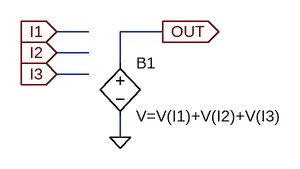
[diagram p0: schematic Sum3p.asc]
Sum3p.asc, the LTspice schematic file:
Version 4
SHEET 1 1188 680
WIRE 304 224 256 224
WIRE 416 224 352 224
WIRE 304 256 256 256
WIRE 352 272 352 224
WIRE 304 288 256 288
WIRE 352 384 352 352
FLAG 256 224 I1
IOPIN 256 224 In
FLAG 416 224 OUT
IOPIN 416 224 Out
FLAG 352 384 0
FLAG 256 256 I2
IOPIN 256 256 In
FLAG 256 288 I3
IOPIN 256 288 In
SYMBOL bv 352 256 R0
SYMATTR InstName B1
SYMATTR Value V=V(I1)+V(I2)+V(I3)

The netlist it stands for:
* Sum3p.asc
B1 OUT 0 V=V(I1)+V(I2)+V(I3)
.backanno
.end